# Altium schematic sheet High-Side Driver.SchDoc
size A4; SheetNumber: 8; SheetTotal: 9
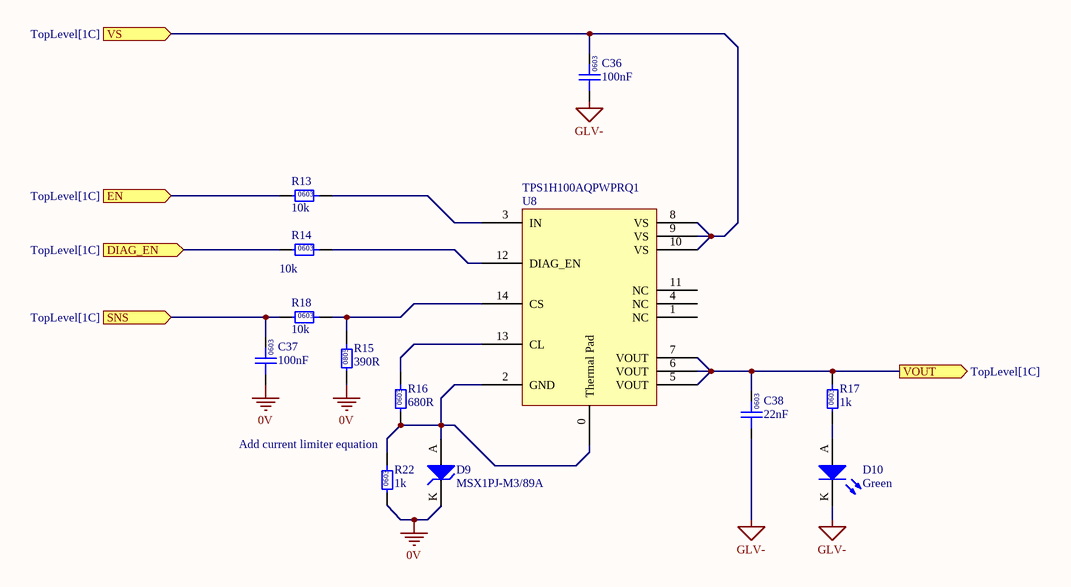
[diagram p0: High-Side Driver.SchDoc]

## Parts
C36  100nF  [0603]
C37  100nF  [0603]
C38  22nF  [0603]
D9  MSX1PJ-M3/89A  [VISHAY DO-219]
D10  Green  [0805 LED]
R13  10k  [0603]
R14  10k  [0603]
R15  390R  [0805]
R16  680R  [0603]
R17  1k  [0603]
R18  10k  [0603]
R22  1k  [0603]
U8  TPS1H100AQPWPRQ1  [TI_14_TSSOP]

## Ports
DIAG_EN (in, see TopLevel[1C]), EN (in, see TopLevel[1C]), SNS (in, see TopLevel[1C]), VOUT (out, see TopLevel[1C]), VS (in, see TopLevel[1C])

## Nets
0V: C37.1 D9.K R15.1 R22.1
GLV-: C36.1 C38.1 D10.K
DIAG_EN: R14.1 ; port DIAG_EN
EN: R13.1 ; port EN
SNS: C37.2 R18.1 ; port SNS
VOUT: C38.2 R17.2 U8.5(VOUT) U8.6(VOUT) U8.7(VOUT) ; port VOUT
VS: C36.2 U8.8(VS) U8.9(VS) U8.10(VS) ; port VS
NetD9_A: D9.A R16.1 R22.2 U8.0(Thermal_Pad) U8.2(GND)
NetD10_A: D10.A R17.1
NetR13_2: R13.2 U8.3(IN)
NetR14_2: R14.2 U8.12(DIAG_EN)
NetR15_2: R15.2 R18.2 U8.14(CS)
NetR16_2: R16.2 U8.13(CL)

Not connected (* = marked no-connect by the designer): U8 1(NC) 4(NC) 11(NC)

## Notes on the sheet
- (near R22) Add current limiter equation
- (in symbol GCM188L81H104KA57D) 0603
- (in symbol GCM188R71H223KA37J) 0603
- (in symbol RC0603FR-071KL) 0603
- (in symbol RC0603FR-0710KL) 0603
- (in symbol RC0603JR-13680RL) 0603
- (in symbol RC0805FR07390RL) 0805

## Library data of the parts
C36 C37 = GCM188L81H104KA57D: Manufacturer: muRata; Rated Voltage: 50V; Tolerance: ±10%; Material: MLCC; Temperature Rating: X8L; Part Number: GCM188L81H104KA57D; Value: 100nF; Digikey Part Number: 490-6049-1-ND
C38 = GCM188R71H223KA37J: Manufacturer: Murata Electronics; Rated Voltage: 50V; Tolerance: ±10%; Material: MLCC; Temperature Rating: X7R; Part Number: GCM188R71H223KA37J; Value: 22nF; Digikey Part Number: 490-8022-2-ND
D9 = MSX1PJ-M3/89A: Manufacturer: Vishay General Semiconductor - Diodes Division; Breakdown Voltage: 600V; Part Number: MSX1PJ-M3/89A
D10 = SML-210FTT86: Green LED Indication - Discrete 1.75V 0805 (2012 Metric); Manufacturer: ROHM Semiconductor; Part Number: SML-210FTT86; Colour: Green; Digikey Part Number: 511-1285-1-ND
R13 R14 R18 = RC0603FR-0710KL: Manufacturer: YAGEO; Tolerance: 0.01; Rated Power: 0.1W; Part Number: RC0603FR-0710KL; Value: 10k; Material: FR-07; Digikey Part Number: 311-10.0KHRCT-ND
R15 = RC0805FR07390RL: Manufacturer: YAGEO; Tolerance: 0.01; Rated Power: 0.125W; Part Number: RC0805FR07390RL; Value: 390R; Material: FR-07; Digikey Part Number: 311-390CRCT-ND
R16 = RC0603JR-13680RL: Manufacturer: YAGEO; Tolerance: 0.01; Rated Power: 0.1W; Part Number: RC0603JR-13680RL; Value: 680R; Material: FR-07; Digikey Part Number: 13-RC0603JR-13680RLCT-ND
R17 R22 = RC0603FR-071KL: Manufacturer: YAGEO; Tolerance: 0.01; Rated Power: 0.1W; Part Number: RC0603FR-071KL; Value: 1k; Material: FR-07; Digikey Part Number: 311-1.00KHRCT-ND
U8 = TPS1H100AQPWPRQ1: IC PWR SWTCH N-CHAN 1:1 14HTSSOP; Manufacturer: Texas Instruments; Complex IC: 1; Part Number: TPS1H100AQPWPRQ1